# Altium schematic sheet v1.5 Power.SchDoc
size A4; DocumentNumber: 2; SheetNumber: 2
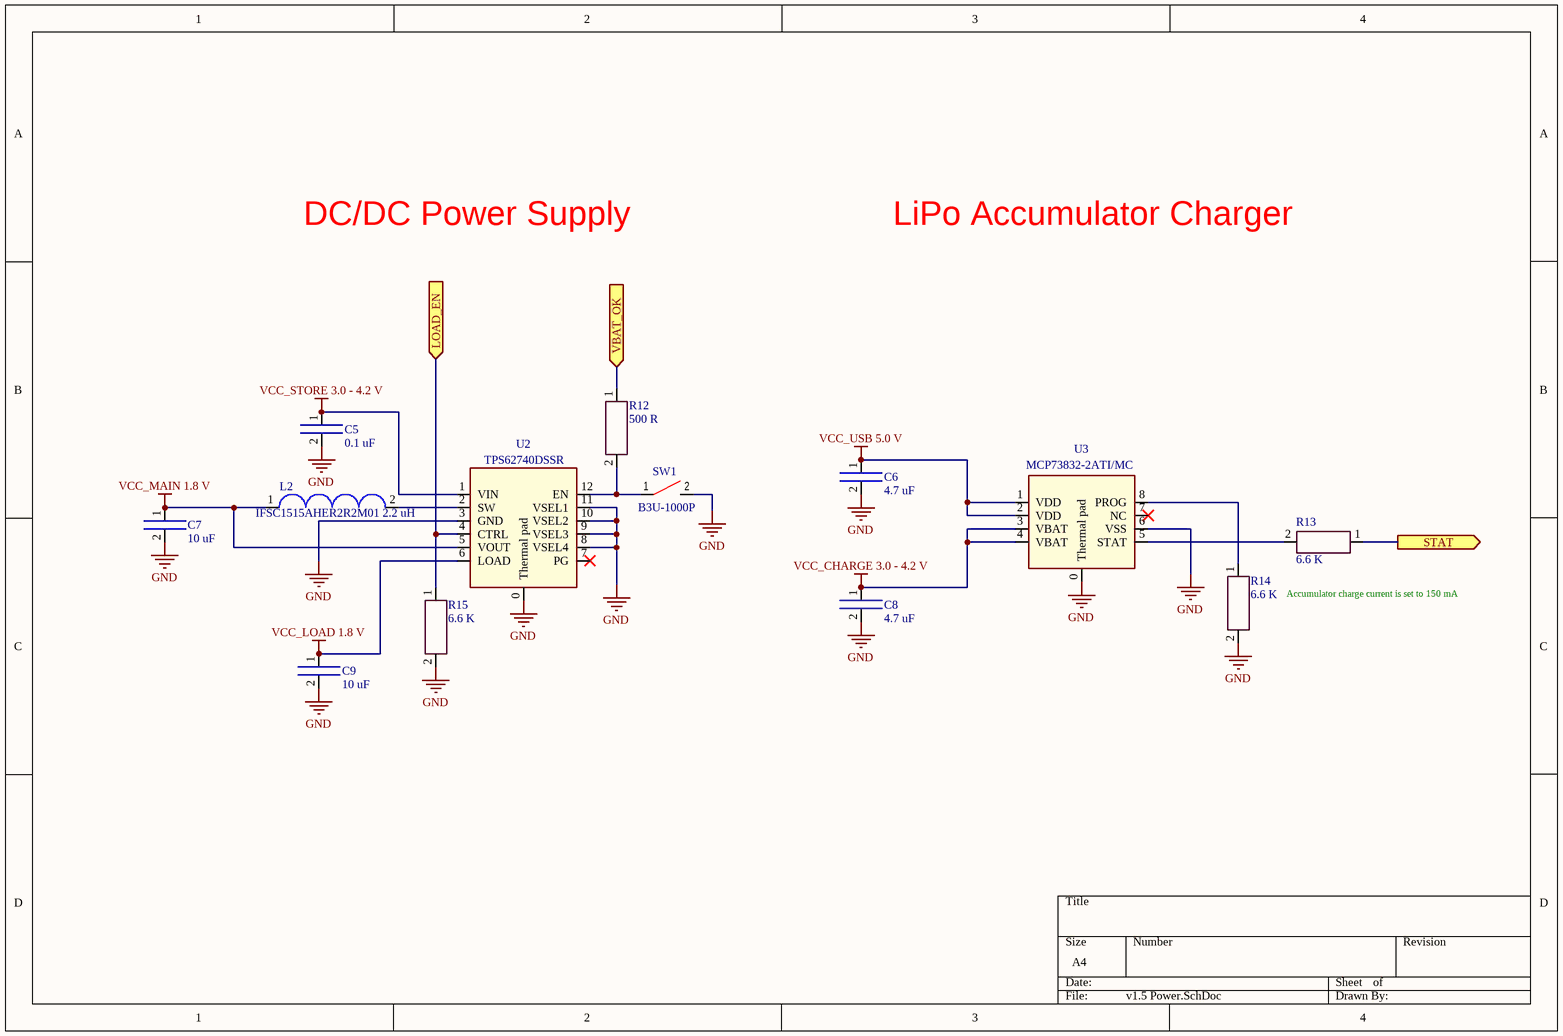
[diagram p0: v1.5 Power.SchDoc]

## Parts
C5  0.1 uF  [0402]
C6  4.7 uF  [0402]
C7  10 uF  [0603]
C8  4.7 uF  [0402]
C9  10 uF  [0603]
L2  IFSC1515AHER2R2M01 2.2 uH  [IFSC1515-AH-01]
R12  500 R  [0402]
R13  6.6 K  [0402]
R14  6.6 K  [0402]
R15  6.6 K  [0402]
SW1  B3U-1000P  [B3U-1000P]
U2  TPS62740DSSR  [TPS62740]
U3  MCP73832-2ATI/MC  [MCP73832-2ATI/MC]

## Ports
LOAD_EN (in), STAT (out), VBAT_OK (in)

## Nets
GND: C5.2 C6.2 C7.2 C8.2 C9.2 R14.2 R15.2 SW1.2 U2.0(Thermal_pad) U2.3(GND) U2.8(VSEL4) U2.9(VSEL3) U2.10(VSEL2) U2.11(VSEL1) U3.0(Thermal_pad) U3.6(VSS)
VCC_CHARGE 3.0 - 4.2 V: C8.1 U3.3(VBAT) U3.4(VBAT)
VCC_LOAD 1.8 V: C9.1 U2.6(LOAD)
VCC_MAIN 1.8 V: C7.1 L2.1 U2.5(VOUT)
VCC_STORE 3.0 - 4.2 V: C5.1 U2.1(VIN)
VCC_USB 5.0 V: C6.1 U3.1(VDD) U3.2(VDD)
LOAD_EN: R15.1 U2.4(CTRL) ; port LOAD_EN
STAT: R13.1 ; port STAT
VBAT_OK: R12.1 ; port VBAT_OK
NetL2_2: L2.2 U2.2(SW)
NetR12_2: R12.2 SW1.1 U2.12(EN)
NetR13_2: R13.2 U3.5(STAT)
NetR14_1: R14.1 U3.8(PROG)

Not connected (* = marked no-connect by the designer): U2 7(PG)*; U3 7(NC)*

## Notes on the sheet
- DC/DC Power Supply
- LiPo Accumulator Charger
- Accumulator charge current is set to 150 mA

## Library data of the parts
C5-C9 = Capasistor
L2 = Inductor
R12-R15 = Resistor
SW1 = Tact switch
U2 = TPS62740